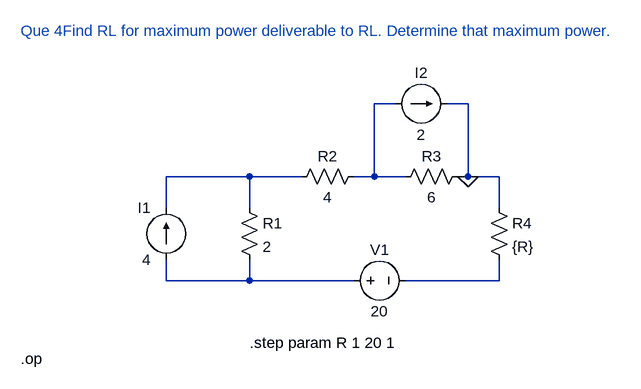
[diagram p0: schematic 4_Dheerendra_23EE019_power_transfer.asc]
4_Dheerendra_23EE019_power_transfer.asc, the LTspice schematic file:
Version 4
SHEET 1 880 680
WIRE 384 -32 352 -32
WIRE 496 -32 464 -32
WIRE 160 80 32 80
WIRE 240 80 160 80
WIRE 352 80 352 -32
WIRE 352 80 320 80
WIRE 400 80 352 80
WIRE 496 80 496 -32
WIRE 496 80 480 80
WIRE 544 80 496 80
WIRE 32 128 32 80
WIRE 160 128 160 80
WIRE 544 128 544 80
WIRE 32 240 32 208
WIRE 160 240 160 208
WIRE 160 240 32 240
WIRE 320 240 160 240
WIRE 544 240 544 208
WIRE 544 240 400 240
FLAG 496 80 0
SYMBOL current 32 208 R180
WINDOW 0 24 80 Left 2
WINDOW 3 24 0 Left 2
WINDOW 123 0 0 Left 0
WINDOW 39 0 0 Left 0
SYMATTR InstName I1
SYMATTR Value 4
SYMBOL res 144 112 R0
SYMATTR InstName R1
SYMATTR Value 2
SYMBOL res 336 64 R90
WINDOW 0 0 56 VBottom 2
WINDOW 3 32 56 VTop 2
SYMATTR InstName R2
SYMATTR Value 4
SYMBOL res 496 64 R90
WINDOW 0 0 56 VBottom 2
WINDOW 3 32 56 VTop 2
SYMATTR InstName R3
SYMATTR Value 6
SYMBOL voltage 304 240 R270
WINDOW 0 32 56 VTop 2
WINDOW 3 -32 56 VBottom 2
WINDOW 123 0 0 Left 0
WINDOW 39 0 0 Left 0
SYMATTR InstName V1
SYMATTR Value 20
SYMBOL res 528 112 R0
SYMATTR InstName R4
SYMATTR Value {R}
SYMBOL current 384 -32 R270
WINDOW 0 32 40 VTop 2
WINDOW 3 -32 40 VBottom 2
WINDOW 123 0 0 Left 0
WINDOW 39 0 0 Left 0
SYMATTR InstName I2
SYMATTR Value 2
TEXT -192 -144 Left 2 ;Que 4Find RL for maximum power deliverable to RL. Determine that maximum power.
TEXT 160 336 Left 2 !.step param R 1 20 1
TEXT -192 360 Left 2 !.op

The netlist it stands for:
* 4_Dheerendra_23EE019_power_transfer.asc
I1 N003 N002 4
R1 N002 N003 2
R2 N001 N002 4
R3 0 N001 6
V1 N003 N004 20
R4 0 N004 {R}
I2 N001 0 2
* Que 4Find RL for maximum power deliverable to RL. Determine that maximum power.
.step param R 1 20 1
.op
.backanno
.end